# EAGLE schematic ControlModuleMW (EAGLE 7.7.0)
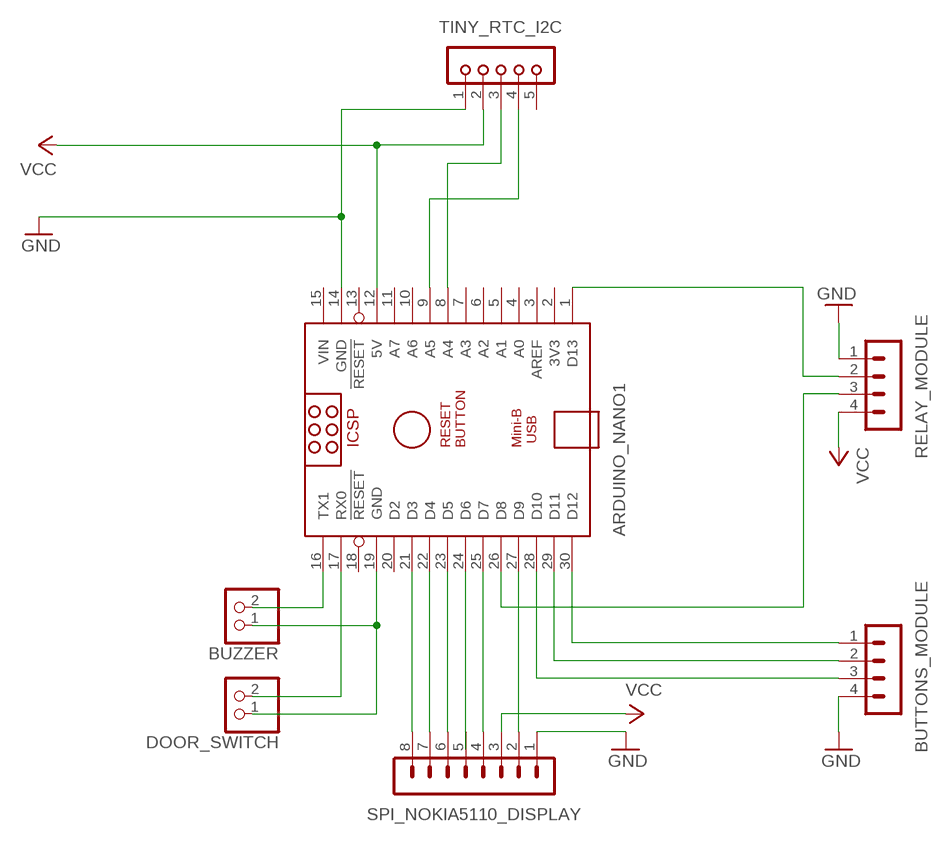
[diagram p0: schematic, sheet 1]

## Parts
ARDUINO_NANO1  ARDUINO_NANO  [ARDUINO_NANO]
BUTTONS_MODULE  MA04-1  [MA04-1]
BUZZER  PINHD-1X2  [1X02]
DOOR_SWITCH  PINHD-1X2  [1X02]
RELAY_MODULE  MA04-1  [MA04-1]
SPI_NOKIA5110_DISPLAY  MA08-1  [MA08-1]
TINY_RTC_I2C  JU05  [JU05]

## Nets
GND: ARDUINO_NANO1.14(GND) BUTTONS_MODULE.4 RELAY_MODULE.1 SPI_NOKIA5110_DISPLAY.1 TINY_RTC_I2C.1
N$1: ARDUINO_NANO1.25(D7) SPI_NOKIA5110_DISPLAY.4
N$2: ARDUINO_NANO1.8(A4) TINY_RTC_I2C.3
N$3: ARDUINO_NANO1.9(A5) TINY_RTC_I2C.4
N$4: ARDUINO_NANO1.24(D6)
N$5: ARDUINO_NANO1.23(D5) SPI_NOKIA5110_DISPLAY.6
N$6: ARDUINO_NANO1.22(D4) SPI_NOKIA5110_DISPLAY.7
N$7: ARDUINO_NANO1.21(D3) SPI_NOKIA5110_DISPLAY.8
N$8: ARDUINO_NANO1.27(D9) SPI_NOKIA5110_DISPLAY.2
N$9: ARDUINO_NANO1.26(D8) RELAY_MODULE.3
N$10: ARDUINO_NANO1.1(D13) RELAY_MODULE.2
N$11: ARDUINO_NANO1.30(D12) BUTTONS_MODULE.1
N$12: ARDUINO_NANO1.29(D11) BUTTONS_MODULE.2
N$13: ARDUINO_NANO1.28(D10) BUTTONS_MODULE.3
N$14: ARDUINO_NANO1.16(TX1) BUZZER.2
N$15: ARDUINO_NANO1.19(GND) BUZZER.1 DOOR_SWITCH.1
N$16: ARDUINO_NANO1.17(RX0) DOOR_SWITCH.2
VCC: ARDUINO_NANO1.12(5V) RELAY_MODULE.4 SPI_NOKIA5110_DISPLAY.3 TINY_RTC_I2C.2
Unconnected: ARDUINO_NANO1.2(3V3) ARDUINO_NANO1.3(AREF) ARDUINO_NANO1.4(A0) ARDUINO_NANO1.5(A1) ARDUINO_NANO1.6(A2) ARDUINO_NANO1.7(A3) ARDUINO_NANO1.10(A6) ARDUINO_NANO1.11(A7) ARDUINO_NANO1.13(!RESET) ARDUINO_NANO1.18(!RESET) ARDUINO_NANO1.20(D2) SPI_NOKIA5110_DISPLAY.5 TINY_RTC_I2C.5

## Power pins joined to a net without a drawn wire
VIN: ARDUINO_NANO1.15(VIN)

## Library data of the parts
ARDUINO_NANO1 = ArduinoNanoV30:ARDUINO_NANO: Arduino Nano V3.0 Overview: The Arduino Nano is a small, complete, and breadboard-friendly board based on the ATmega328 (Arduino Nano 3.x) or ATmega168 (Arduino Nano 2.x). It has more or less the same functionality of the Arduino Duemilanove, but in a different package. It lacks only a DC power jack, and works with a Mini-B USB cable instead of a standard one. The Nano was designed and is being produced by Gravitech. Specifications: Microcontroller Atmel ATmega168 or ATmega328 Operating Voltage (logic level) 5 V Input Voltage (recommended) 7-12 V Input Voltage (limits) 6-20 V Digital I/O Pins 14 (of which 6 provide PWM output) Analog Input Pins 8 DC Current per I/O Pin 40 mA Flash Memory 16 KB (ATmega168) or 32 KB (ATmega328) of which 2 KB used by bootloader SRAM 1 KB (ATmega168) or 2 KB (ATmega328) EEPROM 512 bytes (ATmega168) or 1 KB (ATmega328) Clock Speed 16 MHz Dimensions 0.73" x 1.70" Length 45 mm Width 18 mm Weigth 5 g Power: The Arduino Nano can be powered via the Mini-B USB connection, 6-20V unregulated external power supply (pin 30), or 5V regulated external power supply (pin 27). The power source is automatically selected to the highest voltage source. Memory: The ATmega168 has 16 KB of flash memory for storing code (of which 2 KB is used for the bootloader); the ATmega328 has 32 KB, (also with 2 KB used for the bootloader). The ATmega168 has 1 KB of SRAM and 512 bytes of EEPROM (which can be read and written with the EEPROM library); the ATmega328 has 2 KB of SRAM and 1 KB of EEPROM. Input and Output: Each of the 14 digital pins on the Nano can be used as an input or output, using pinMode(), digitalWrite(), and digitalRead() functions. They operate at 5 volts. Each pin can provide or receive a maximum of 40 mA and has an internal pull-up resistor (disconnected by default) of 20-50 kOhms. In addition, some pins have specialized functions. Visit Arduino - ArduinoBoardNano <https://www.arduino.cc/en/Main/ArduinoBoardNano>
BUTTONS_MODULE RELAY_MODULE = con-lstb:MA04-1: PIN HEADER; OC_FARNELL: unknown; OC_NEWARK: unknown
BUZZER DOOR_SWITCH = pinhead:PINHD-1X2: PIN HEADER
SPI_NOKIA5110_DISPLAY = con-lstb:MA08-1: PIN HEADER; OC_FARNELL: unknown; OC_NEWARK: unknown
TINY_RTC_I2C = con-lsta:JU05: PIN HEADER; OC_FARNELL: unknown; OC_NEWARK: unknown